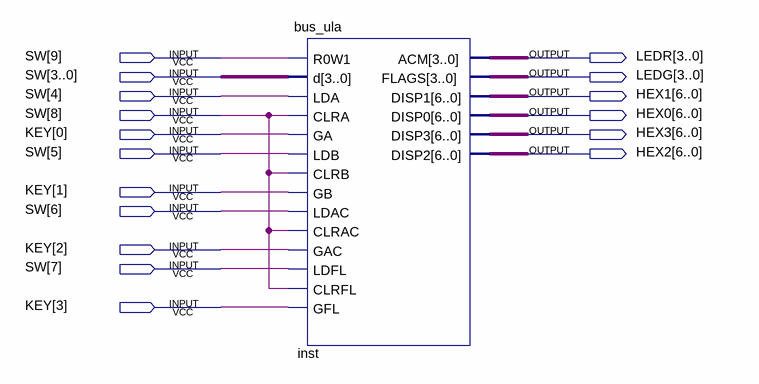
[diagram p0: schematic sheet]
// Quartus schematic bus_ula_teste.bdf as structural Verilog: 1 symbols, 17 pins
module bus_ula_teste (
  input  [9:0] SW,
  input  [3:0] KEY,
  output [3:0] LEDR,
  output [3:0] LEDG,
  output [6:0] HEX1,
  output [6:0] HEX0,
  output [6:0] HEX3,
  output [6:0] HEX2
);

  bus_ula inst (
    .R0W1(SW[9]), .d(SW[3:0]), .LDA(SW[4]), .CLRA(SW[8]), .GA(KEY[0]), .LDB(SW[5]), .CLRB(SW[8]),
    .GB(KEY[1]), .LDAC(SW[6]), .CLRAC(SW[8]), .GAC(KEY[2]), .LDFL(SW[7]), .CLRFL(SW[8]), .GFL(KEY[3]),
    .ACM(LEDR), .FLAGS(LEDG), .DISP1(HEX1), .DISP0(HEX0), .DISP3(HEX3), .DISP2(HEX2));
endmodule
